# EAGLE design remote (EAGLE 6.2)
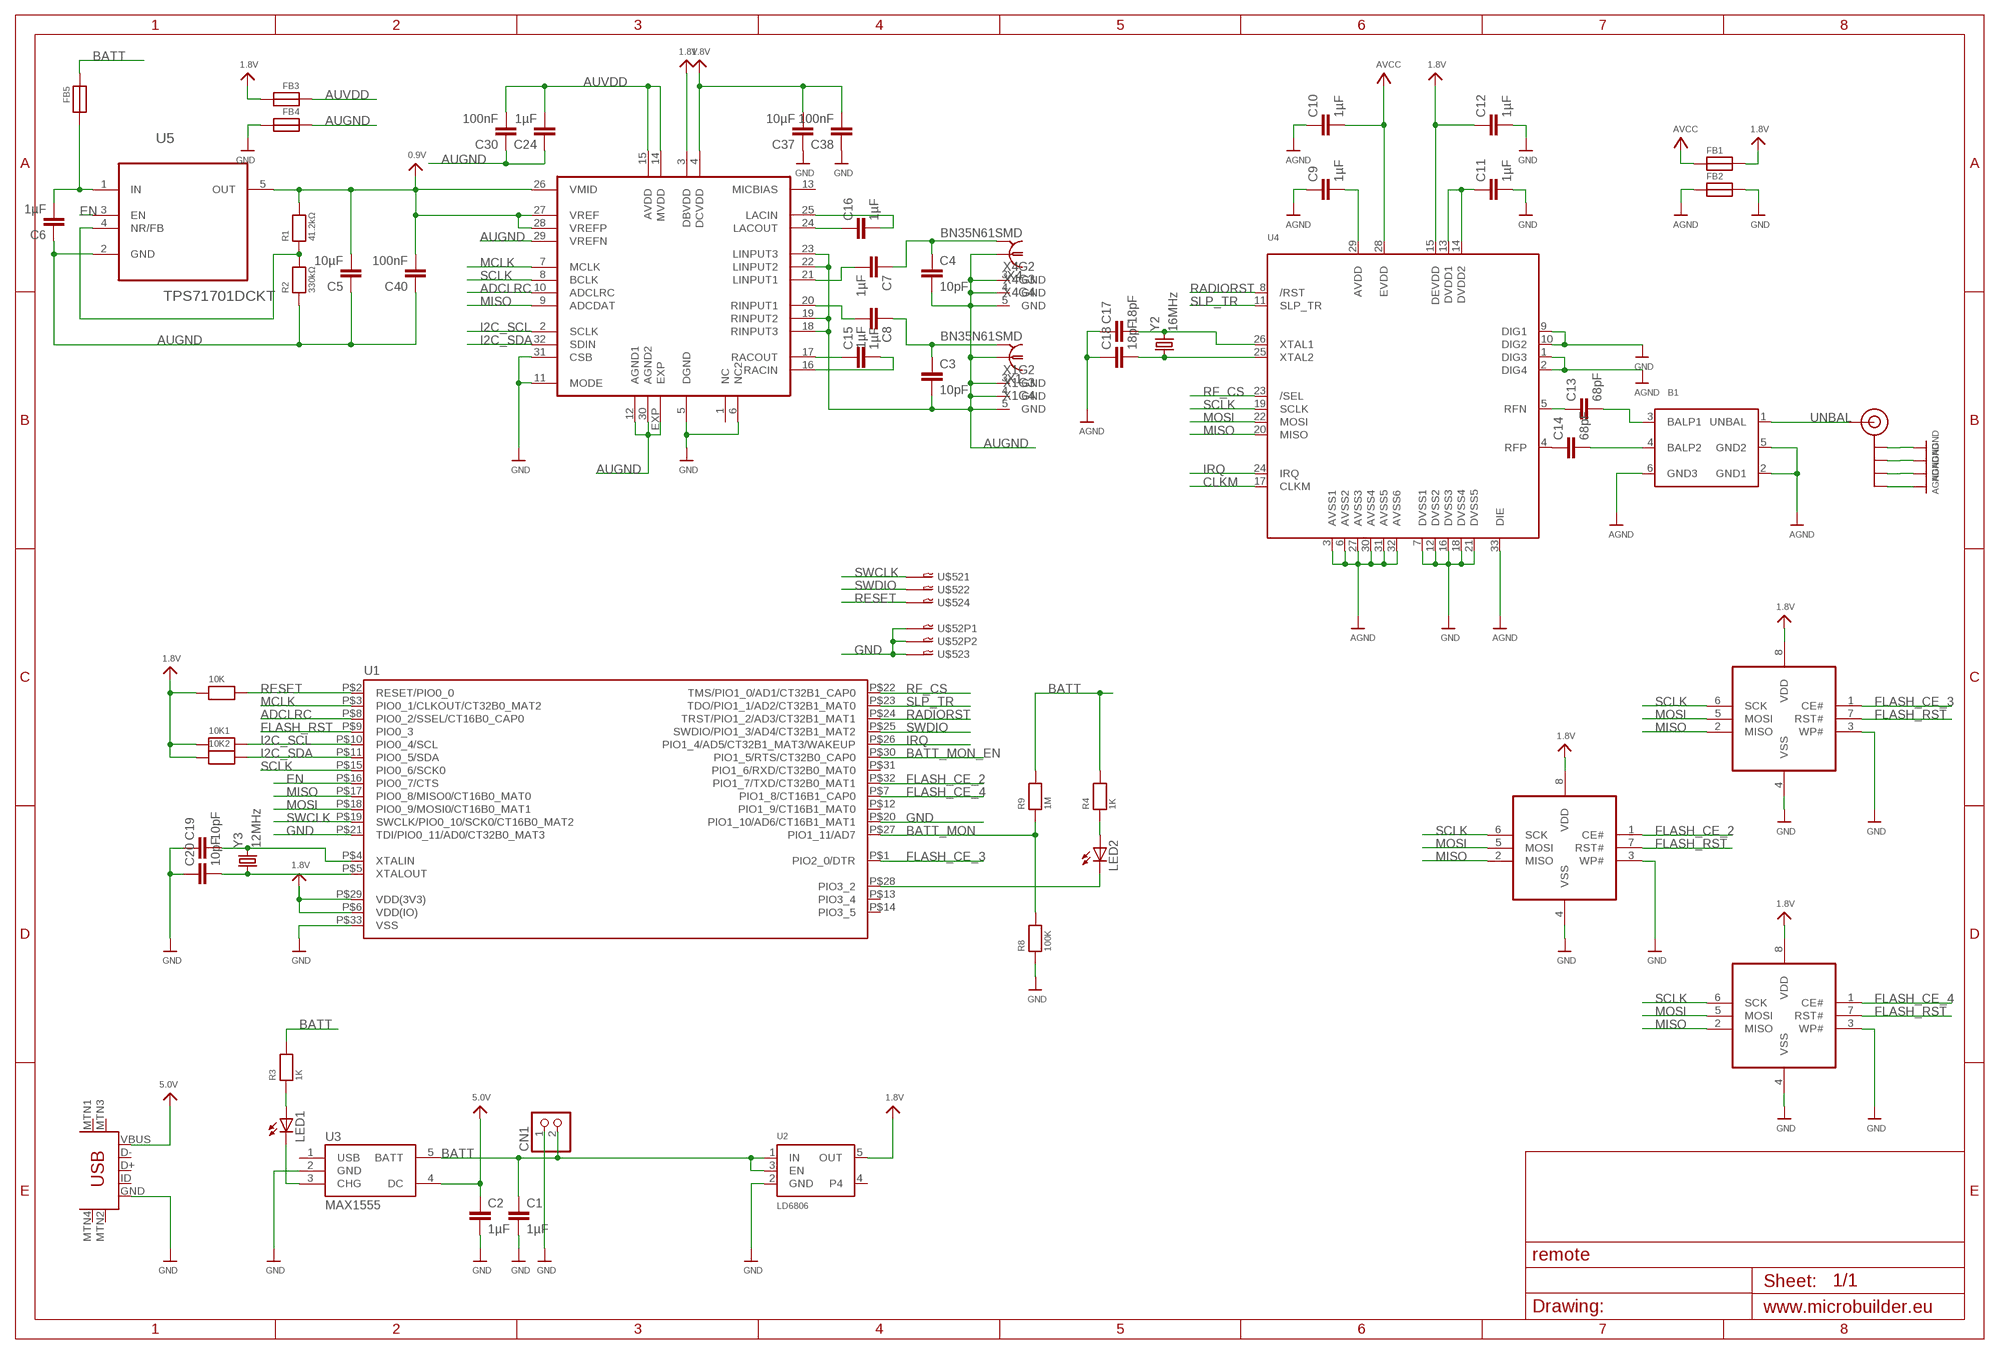
[diagram p0: schematic, sheet 1]

## Parts
10K  RESISTOR0603MINI  [0603-MINI]
10K1  RESISTOR0603MINI  [0603-MINI]
10K2  RESISTOR0603MINI  [0603-MINI]
B1  BALUN+LP  [BALUN0805]
C1  1µF  C-EUC0603K  [C0603K]
C2  1µF  C-EUC0603K  [C0603K]
C3  10pF  C-EUC0603K  [C0603K]
C4  10pF  C-EUC0603K  [C0603K]
C5  10µF  C-EUC0603K  [C0603K]
C6  1µF  C-EUC0603K  [C0603K]
C7  1µF  C-EUC0603K  [C0603K]
C8  1µF  C-EUC0603K  [C0603K]
C9  1µF  C-EUC0603K  [C0603K]
C10  1µF  C-EUC0603K  [C0603K]
C11  1µF  C-EUC0603K  [C0603K]
C12  1µF  C-EUC0603K  [C0603K]
C13  68pF  C-EUC0603K  [C0603K]
C14  68pF  C-EUC0603K  [C0603K]
C15  1µF  C-EUC0603K  [C0603K]
C16  1µF  C-EUC0603K  [C0603K]
C17  18pF  C-EUC0603K  [C0603K]
C18  18pF  C-EUC0603K  [C0603K]
C19  10pF  C-EUC0603K  [C0603K]
C20  10pF  C-EUC0603K  [C0603K]
C24  1µF  C-EUC0603K  [C0603K]
C30  100nF  C-EUC0603K  [C0603K]
C37  10µF  C-EUC0603K  [C0603K]
C38  100nF  C-EUC0603K  [C0603K]
C40  100nF  C-EUC0603K  [C0603K]
CN1  JST_2PIN  [JSTPH2]
FB1  FERRITE  [0603]
FB2  FERRITE  [0603]
FB3  FERRITE  [0603]
FB4  FERRITE  [0603]
FB5  FERRITE  [0603]
J$1  SMA_EDGE  [SMA-EDGE]
LED1  LEDCHIPLED_0603  [CHIPLED_0603]
LED2  LEDCHIPLED_0603  [CHIPLED_0603]
R1  41.2kΩ  RESISTOR0603MINI  [0603-MINI]
R2  330kΩ  RESISTOR0603MINI  [0603-MINI]
R3  1K  RESISTOR0603MINI  [0603-MINI]
R4  1K  RESISTOR0603MINI  [0603-MINI]
R8  100K  RESISTOR0603MINI  [0603-MINI]
R9  1M  RESISTOR0603MINI  [0603-MINI]
U1  LPC1113/4_QFN  [HVQFN33-7X7]
U2  LD6806  VREG_SOT23-5  [SOT23-5]
U3  MAX1555  [SOT23-5]
U4  AT86RF212  [32QN2]
U5  TPS71701DCKT  [SOT65P210X110-5N]
U$1  SST25WF  [ZA]
U$14  WM8737  [DM030FL]
U$16  USB-MINIB-5PIN  [USB-MINIB]
U$22  SST25WF  [ZA]
U$26  SST25WF  [ZA]
U$52  SM04B-SURS-TF  [SM04B-SURS-TF]
X1  BN35N61SMD  [B35N61_SMD]
X4  BN35N61SMD  [B35N61_SMD]
Y2  16MHz  CRYSTAL5X3  [CRYSTAL-SMD-5X3]
Y3  12MHz  CRYSTAL5X3  [CRYSTAL-SMD-5X3]

## Nets
0.9V: C5.2 C40.2 R1.2 U5.5(OUT) U$14.26(VMID) U$14.27(VREF) U$14.28(VREFP)
1.8V: 10K1.1 10K2.1 10K.1 C12.1 C37.2 C38.2 FB1.2 FB3.2 U1.P$6(VDD(IO)) U1.P$29(VDD(3V3)) U2.5(OUT) U4.15(DEVDD) U$1.8(VDD) U$14.3(DBVDD) U$14.4(DCVDD) U$22.8(VDD) U$26.8(VDD)
5.0V: C2.1 U3.4(DC) U$16.VBUS
ADCLRC: U1.P$8(PIO0_2/SSEL/CT16B0_CAP0) U$14.10(ADCLRC)
AGND: B1.2(GND1) B1.5(GND2) B1.6(GND3) C9.1 C10.1 C17.1 C18.1 FB2.1 J$1.GND@0(GND) J$1.GND@1(GND) J$1.GND@2(GND) J$1.GND@3(GND) U4.1(DIG3) U4.2(DIG4) U4.3(AVSS1) U4.6(AVSS2) U4.27(AVSS3) U4.30(AVSS4) U4.31(AVSS5) U4.32(AVSS6) U4.33(DIE)
AUBATT: C6.2 FB5.2 U5.1(IN)
AUGND: C3.2 C4.2 C5.1 C6.1 C24.1 C30.1 C40.1 FB4.1 R2.1 U5.2(GND) U$14.12(AGND1) U$14.18(RINPUT3) U$14.19(RINPUT2) U$14.22(LINPUT2) U$14.23(LINPUT3) U$14.29(VREFN) U$14.30(AGND2) U$14.EXP X1.2 X1.3(GND) X1.4(GND) X1.5(GND) X4.2 X4.3(GND) X4.4(GND) X4.5(GND)
AUVDD: C24.2 C30.2 FB3.1 U$14.14(MVDD) U$14.15(AVDD)
AVCC: C10.2 FB1.1 U4.28(EVDD)
AVDD-IN: C9.2 U4.29(AVDD)
BALP1: B1.3(BALP1) C13.2
BALP2: B1.4(BALP2) C14.2
BATT: C1.1 CN1.2 FB5.1 R3.2 R4.2 R9.2 U2.1(IN) U2.3(EN) U3.5(BATT)
BATT_MON: R8.2 R9.1 U1.P$27(PIO1_11/AD7)
BATT_MON_EN: U1.P$30(PIO1_5/RTS/CT32B0_CAP0)
CHG: LED1.C U3.3(CHG)
CHG_LED: LED1.A R3.1
CHG_LED1: LED2.A R4.1
CLKM: U4.17(CLKM)
EN: U1.P$16(PIO0_7/CTS) U5.3(EN)
FLASH_CE_2: U1.P$32(PIO1_7/TXD/CT32B0_MAT1) U$26.1(CE#)
FLASH_CE_3: U1.P$1(PIO2_0/DTR) U$22.1(CE#)
FLASH_CE_4: U1.P$7(PIO1_8/CT16B1_CAP0) U$1.1(CE#)
FLASH_RST: U1.P$9(PIO0_3) U$1.7(RST#) U$22.7(RST#) U$26.7(RST#)
GND: C1.2 C2.2 C11.2 C12.2 C19.1 C20.1 C37.1 C38.1 CN1.1 FB2.2 FB4.2 R8.1 U1.P$20(PIO1_10/AD6/CT16B1_MAT1) U1.P$21(TDI/PIO0_11/AD0/CT32B0_MAT3) U1.P$33(VSS) U2.2(GND) U3.2(GND) U4.7(DVSS1) U4.9(DIG1) U4.10(DIG2) U4.12(DVSS2) U4.16(DVSS3) U4.18(DVSS4) U4.21(DVSS5) U$1.3(WP#) U$1.4(VSS) U$14.5(DGND) U$14.6(NC2) U$14.11(MODE) U$14.31(CSB) U$16.GND U$22.3(WP#) U$22.4(VSS) U$26.3(WP#) U$26.4(VSS) U$52.3 U$52.GND1 U$52.GND2
I2C_SCL: 10K1.2 U1.P$10(PIO0_4/SCL) U$14.2(SCLK)
I2C_SDA: 10K2.2 U1.P$11(PIO0_5/SDA) U$14.32(SDIN)
IRQ: U1.P$26(PIO1_4/AD5/CT32B1_MAT3/WAKEUP) U4.24(IRQ)
LPC_XTAL1: C19.2 U1.P$4(XTALIN) Y3.3
LPC_XTAL2: C20.2 U1.P$5(XTALOUT) Y3.1
MCLK: U1.P$3(PIO0_1/CLKOUT/CT32B0_MAT2) U$14.7(MCLK)
MISO: U1.P$17(PIO0_8/MISO0/CT16B0_MAT0) U4.20(MISO) U$1.2(MISO) U$14.9(ADCDAT) U$22.2(MISO) U$26.2(MISO)
MOSI: U1.P$18(PIO0_9/MOSI0/CT16B0_MAT1) U4.22(MOSI) U$1.5(MOSI) U$22.5(MOSI) U$26.5(MOSI)
N$1: LED2.C U1.P$28(PIO3_2)
N$2: C8.2 U$14.20(RINPUT1)
N$3: C3.1 C8.1 X1.1(GND)
N$4: C4.1 C7.1 X4.1(GND)
N$5: C11.1 U4.13(DVDD1) U4.14(DVDD2)
N$6: C7.2 U$14.21(LINPUT1)
N$7: C16.1 U$14.24(LACOUT)
N$8: C15.1 U$14.17(RACOUT)
N$9: C16.2 U$14.25(LACIN)
N$10: C15.2 U$14.16(RACIN)
N$11: R1.1 R2.2 U5.4(NR/FB)
RADIORST: U1.P$24(TRST/PIO1_2/AD3/CT32B1_MAT1) U4.8(/RST)
RESET: 10K.2 U1.P$2(RESET/PIO0_0) U$52.4
RF_CS: U1.P$22(TMS/PIO1_0/AD1/CT32B1_CAP0) U4.23(/SEL)
RF_XTAL1: C17.2 U4.26(XTAL1) Y2.3
RF_XTAL2: C18.2 U4.25(XTAL2) Y2.1
RFN: C13.1 U4.5(RFN)
RFP: C14.1 U4.4(RFP)
SCLK: U1.P$15(PIO0_6/SCK0) U4.19(SCLK) U$1.6(SCK) U$14.8(BCLK) U$22.6(SCK) U$26.6(SCK)
SLP_TR: U1.P$23(TDO/PIO1_1/AD2/CT32B1_MAT0) U4.11(SLP_TR)
SWCLK: U1.P$19(SWCLK/PIO0_10/SCK0/CT16B0_MAT2) U$52.1
SWDIO: U1.P$25(SWDIO/PIO1_3/AD4/CT32B1_MAT2) U$52.2
UNBAL: B1.1(UNBAL) J$1.SIG(SIGNAL)
Unconnected: U1.P$12(PIO1_9/CT16B1_MAT0) U1.P$13(PIO3_4) U1.P$14(PIO3_5) U1.P$31(PIO1_6/RXD/CT32B0_MAT0) U2.4 U3.1(USB) U$14.1(NC) U$14.13(MICBIAS) U$16.D+ U$16.D- U$16.ID U$16.MTN1(MTN2) U$16.MTN2(MTN3) U$16.MTN3(MTN1) U$16.MTN4

## Library data of the parts
10K 10K1 10K2 R1-R4 R8 R9 = microbuilder:RESISTOR: Resistors 0402 - 0402 Surface Mount Package 22 Ohm 1% 1/16W [Digikey: 311-22.0LRTR-ND] 33 Ohm 5% 1/16W 1.0K 5% 1/16W 1.5K 5% 1/16W 2.0K 1% 1/16W 10.0K 1% 1/16W [Digikey: 311-10.0KLRTR-ND] 10.0K 5% 1/16W [Digikey: RMCF0402JT10K0TR-ND] 12.1K 1% 1/16W [Digikey: 311-22.0LRTR-ND] 100.0K 5% 1/16W 0603 - 0603 Surface Mount Package 0 Ohm 1/10 Watt 1% Resistor 15 Ohm 1/10 Watt 1% Resistor 33 Ohm 1/10 Watt 1% Resistor 49.9 Ohm 1/10 Watt 1% Resistor 100 Ohm 1/10 Watt 1% Resistor 150 Ohm 1/10 Watt 1% Resistor 240 Ohm 1/10 Watt 1% Resistor 390 Ohm 1/10 Watt 1% Resistor 560 Ohm 1/10 Watt 1% Resistor 680 Ohm 1/10 Watt 1% Resistor 750 Ohm 1/10 Watt 1% Resistor 1.0K Ohm 1/10 Watt 1% Resistor 1.5K Ohm 1/10 Watt 1% Resistor 2.0K Ohm 1/10 Watt 1% Resistor 2.2K Ohm 1/10 Watt 1% Resistor 3.3K Ohm 1/10 Watt 1% Resistor 4.7K Ohm 1/10 Watt 1% Resistor 10.0K Ohm 1/10 Watt 1% Resistor 12.0K Ohm 1/10 Watt 1% Resistor 12.1K Ohm 1/10 Watt 1% Resistor 20.0K Ohm 1/10 Watt 1% Resistor 33.0K Ohm 1/10 Watt 1% Resistor 100.0K Ohm 1/10 Watt 1% Resistor 0805 - 0805 Surface Mount Package 0 Ohm 1/8 Watt 1% Resistor 33 Ohm 1/8 Watt 1% Resistor 100 Ohm 1/8 Watt 1% Resistor 150 Ohm 1/8 Watt 1% Resistor 200 Ohm 1/8 Watt 1% Resistor 240 Ohm 1/8 Watt 1% Resistor 330 Ohm 1/8 Watt 1% Resistor 390 Ohm 1/8 Watt 1% Resistor 470 Ohm 1/8 Watt 1% Resistor 1.0K Ohm 1/8 Watt 1% Resistor 1.5K Ohm 1/8 Watt 1% Resistor 2.0K Ohm 1/8 Watt 1% Resistor 4.7K Ohm 1/8 Watt 1% Resistor 5.1K Ohm 1/8 Watt 1% Resistor 5.6K Ohm 1/8 Watt 1% Resistor 10.0K Ohm 1/8 Watt 1% Resistor 22.0K Ohm 1/8 Watt 1% Resistor 33.0K Ohm 1/8 Watt 1% Resistor 100K Ohm 1/8 Watt 1% Resistor 1206 - 1206 Surface Mount Package 2012 - 2010 Surface Mount Package 0.11 Ohm 1/2 Watt 1% Resistor - Digikey: RHM.11UCT-ND
B1 = microbuilder:BALUN+LP: Balun + Low Pass Filter 0805 863-928 MHz Balun + Low Pass Filter (0805) - Digikey: 712-1473-1-ND
C1-C20 C24 C30 C37 C38 C40 = resistor:C-EU: CAPACITOR, European symbol
CN1 = microbuilder:JST_2PIN: JST 2-Pin Right-Angle Connector PH-Series - 4UConnector: 17311 SH-Series - 4UConnector: 07278
FB1-FB5 = microbuilder:FERRITE: Ferrite Bead 0603 MMZ1608B121C - 120 Ohm, 600mA Ferrite Chip - Digikey: 445-2164-1-ND BK1608HW121-T - 120 Ohm, 600mA Ferrite Chip - Digikey: 587-1876-2-ND
J$1 = SparkFun:SMA_EDGE: SMA Antenna Connector End launch SMA connector. The paste layer has been removed so that the connector can be hand soldered onto the board after reflow.
LED1 LED2 = led:LED: LED OSRAM: - CHIPLED LG R971, LG N971, LY N971, LG Q971, LY Q971, LO R971, LY R971 LH N974, LH R974 LS Q976, LO Q976, LY Q976 LO Q996 - Hyper CHIPLED LW Q18S LB Q993, LB Q99A, LB R99A - SideLED LS A670, LO A670, LY A670, LG A670, LP A670 LB A673, LV A673, LT A673, LW A673 LH A674 LY A675 LS A676, LA A676, LO A676, LY A676, LW A676 LS A679, LY A679, LG A679 - Hyper Micro SIDELED® LS Y876, LA Y876, LO Y876, LY Y876 LT Y87S - SmartLED LW L88C, LW L88S LB L89C, LB L89S, LG L890 LS L89K, LO L89K, LY L89K LS L896, LA L896, LO L896, LY L896 - TOPLED LS T670, LO T670, LY T670, LG T670, LP T670 LSG T670, LSP T670, LSY T670, LOP T670, LYG T670 LG T671, LOG T671, LSG T671 LB T673, LV T673, LT T673, LW T673 LH T674 LS T676, LA T676, LO T676, LY T676, LB T676, LH T676, LSB T676, LW T676 LB T67C, LV T67C, LT T67C, LS T67K, LO T67K, LY T67K, LW E67C LS E67B, LA E67B, LO E67B, LY E67B, LB E67C, LV E67C, LT E67C LW T67C LS T679, LY T679, LG T679 LS T770, LO T770, LY T770, LG T770, LP T770 LB T773, LV T773, LT T773, LW T773 LH T774 LS E675, LA E675, LY E675, LS T675 LS T776, LA T776, LO T776, LY T776, LB T776 LHGB T686 LT T68C, LB T68C - Hyper Mini TOPLED® LB M676 - Mini TOPLED Santana® LG M470 LS M47K, LO M47K, LY M47K Source: http://www.osram.convergy.de LUXEON: - LUMILED® LXK2-PW12-R00, LXK2-PW12-S00, LXK2-PW14-U00, LXK2-PW14-V00 LXK2-PM12-R00, LXK2-PM12-S00, LXK2-PM14-U00 LXK2-PE12-Q00, LXK2-PE12-R00, LXK2-PE12-S00, LXK2-PE14-T00, LXK2-PE14-U00 LXK2-PB12-K00, LXK2-PB12-L00, LXK2-PB12-M00, LXK2-PB14-N00, LXK2-PB14-P00, LXK2-PB14-Q00 LXK2-PR12-L00, LXK2-PR12-M00, LXK2-PR14-Q00, LXK2-PR14-R00 LXK2-PD12-Q00, LXK2-PD12-R00, LXK2-PD12-S00 LXK2-PH12-R00, LXK2-PH12-S00 LXK2-PL12-P00, LXK2-PL12-Q00, LXK2-PL12-R00 Source: www.luxeon.com KINGBRIGHT: KA-3528ASYC Source: www.kingbright.com
U1 = microbuilder:LPC1113/4_QFN: LPC1113/4 ARM Cortex-M0 processor, running at frequencies of up to 50 MHz. QFN 33 Pin Package; DIGIKEY#: 568-4948-ND; MANF: NXP; MANF#: LPC1114FHN33/301,5
U2 = microbuilder_v2:VREG_SOT23-5: SOT23-5 Fixed Voltage Regulators To better organise some of the SOT23-5 fixed voltage regulators in this library, this new part was created. Part Current Out V Out V In V Dropout Digikey Part No. ADP121 150mA 3.3V 3.4-5.5V 0.09V @ 150mA ADP121-AUJZ33R7CT-ND ADP121 150mA 3.0V 3.1-5.5V 0.09V @ 150mA ADP121-AUJZ30R7CT-ND ADP122 300mA 3.3V 3.4-5.5V 0.085V @ 300mA ADP122AUJZ-3.3-R7CT-ND ADP1712 300mA 3.3V 3.5-5.5V 0.17V @ 300mA ADP1712AUJZ-3.3-R7TR-ND AP7311 (Low Cost) 150mA 3.3V 3.5-6V 0.15V @ 150mA AP7311-33WG-7DICT-ND LD39015M18R 150mA 1.8V 1.9V-5.5V 0.08V @ 100mA 497-6977-1-ND MCP1824T-3302E/OT 300mA 3.3V 3.5V-6V 0.2V @ 300mA MCP1824T-3302E/OTCT-ND MIC5205-2.5YM5 TR 150mA 2.5V 2.7-16V 0.165V @ 150mA 576-1257-2-ND MIC5205-3.0YM5 TR 150mA 3.0V 3.2V-16V 0.165V @ 150mA 576-1258-2-ND MIC5205-3.3YM5 TR 150mA 3.3V 3.5V-16V 0.165V @ 150mA 576-1259-2-ND TPS780330220 150mA 3.3V+2.2V 3.6-5.5V 250mV Max 296-23332-1-ND TDA3663/N1,135 100mA 3.3V 3.5-45V 0.18V @ 50mA 568-5343-1-ND
U3 = SparkFun:MAX1555: MAX1555 Lithium Charger IC SOT-23 Lithium Polymer charging IC. Schematic element and footprint proven. Spark Fun Electronics SKU : COM-00674
U4 = microbuilder:AT86RF212: AT86RF212 - Low-Power SPI-based 700/800/900 MHz Transceiver Digikey: AT86RF212-ZU-ND
U5 = TPS71701:TPS71701DCKT: Linear Regulator; MPN: TPS71701DCKT; OC_FARNELL: 1703393; OC_NEWARK: 65M6356; PACKAGE: SC-70-5; SUPPLIER: Texas Instruments
U$1 U$22 U$26 = sst25wf:SST25WF
U$14 = wm8737:WM8737
U$16 = SparkFun:USB-MINIB: Mini-USB "B" connector with 5th pin broken out. Created new symbol breaking out 5th "ID" pin in mini/micro USB connector spec. See: http://en.wikipedia.org/wiki/Mini_usb#Cables. Uses same footprint as 4-pin symbol. Also added pins to connect to mounting / shield pads if required (probably not generally needed as signals aren't shielded once they leave the connector).
U$52 = con-jst:SM04B-SURS-TF
X1 X4 = con-coax:BN35N61: BNC CONNECTOR M/A COM www.macom.com distributor Farnell 149-452
Y2 Y3 = SparkFun:CRYSTAL: Crystals Various standard crystals. Proven footprints. Spark Fun Electronics SKU : COM-00534

## Board
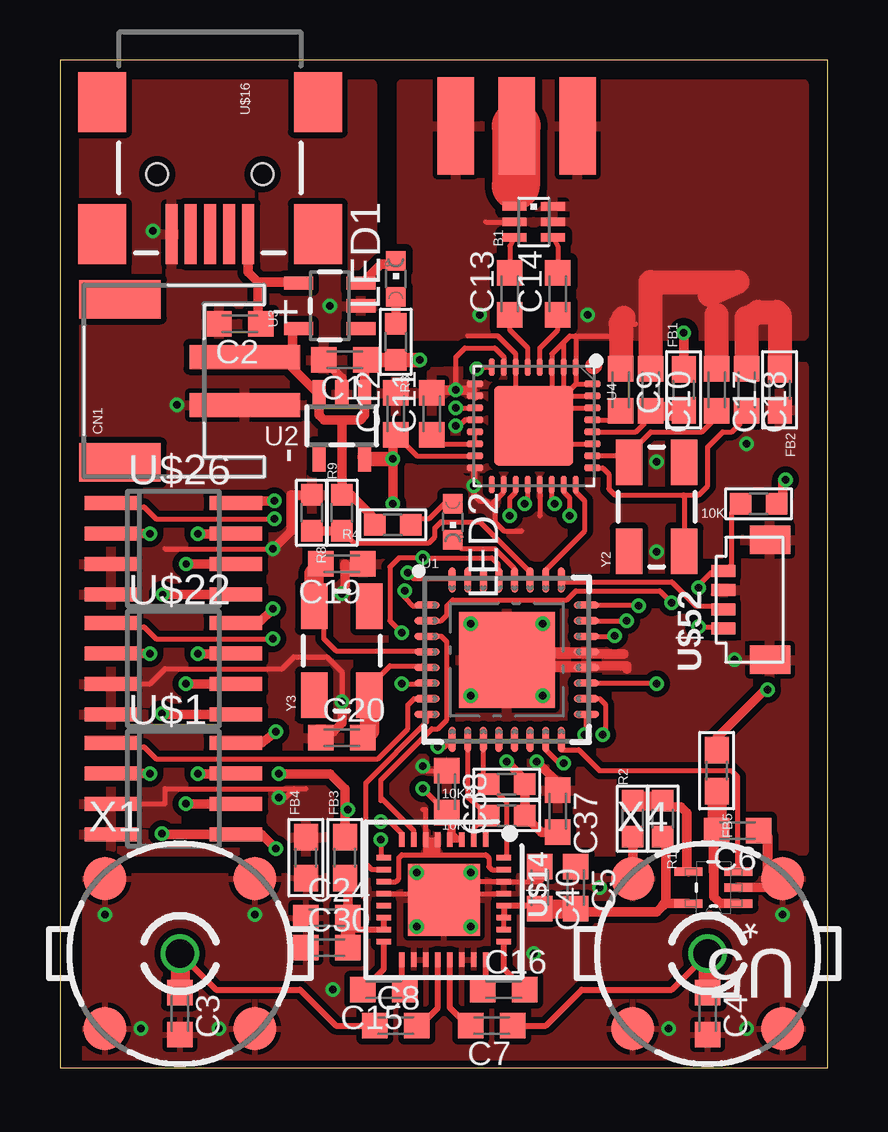
[diagram p1: board, top side]
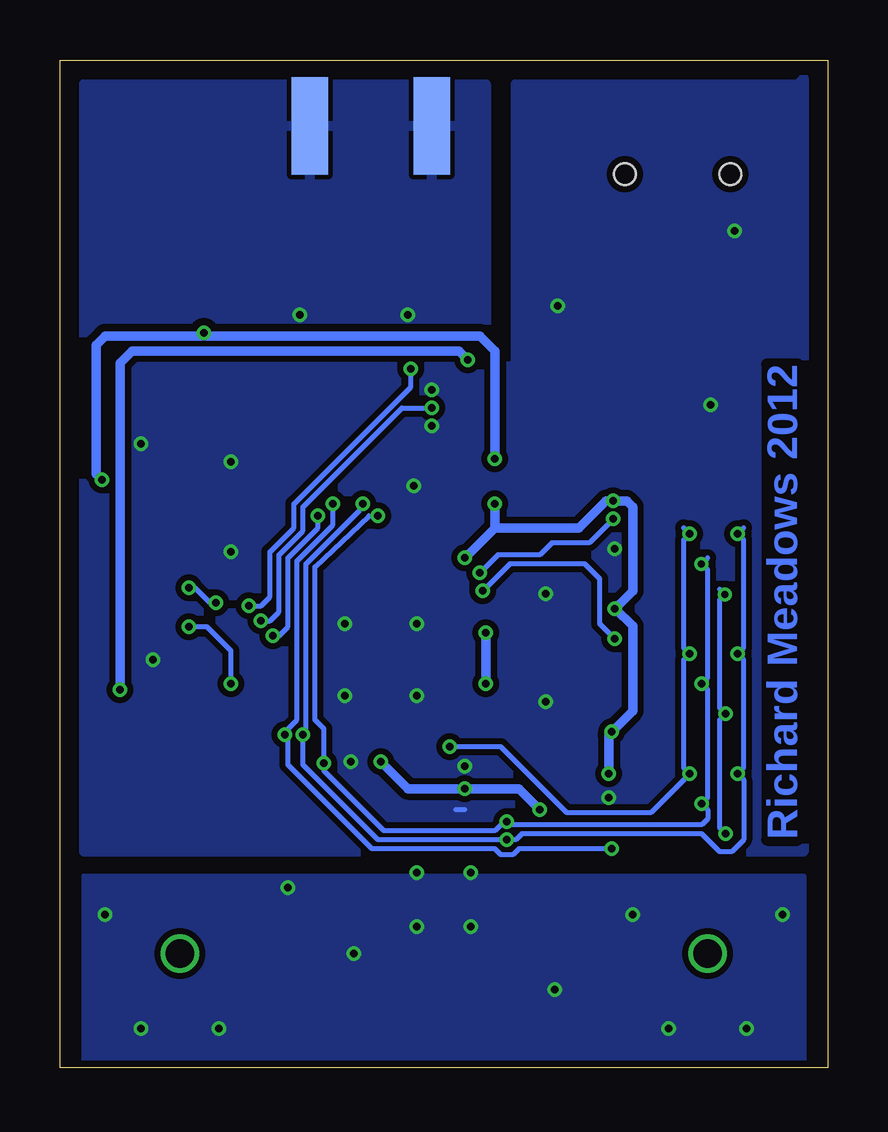
[diagram p2: board, bottom side, seen from below]

Size 32 x 42 mm. Coordinates in mm from the lower left corner, seen from the top.
Outline: 0,0 32,0 32,42 0,42 0,0
Copper layers (1*16): Top 0.035mm / dielectric 1.5mm / Bottom 0.035mm
Design rules: minimum track width 0.15mm, minimum drill 0.3mm, track to track 0.15mm, track to pad 0.15mm, pad to pad 0.15mm, via to via 0.15mm, smd to smd 0.15mm, copper to edge 0.3mm, drill to drill 0.2mm, minimum pad ring 0.2mm, minimum via ring 0.15mm, stop-mask expansion 0.075mm, vias tented up to drill 0mil, thermal gap 0.2mm

### Footprints (pad centres in the part's own frame; a part is rotated, then mirrored left to right if it is on the bottom)
0603-MINI = smd 0.9 x 0.9: 1 -0.75,0; 2 0.75,0
BALUN0805 = smd 0.35 x 1: 1 0.65,0.8; 2 0,0.8; 3 -0.65,0.8; 4 -0.65,-0.8; 5 0,-0.8; 6 0.65,-0.8
C0603K = smd 1.05 x 1.08: 1 -0.875,0; 2 0.875,0
JSTPH2 = smd 1 x 4.6: 1 -1,-3.7; 2 1,-3.7 | smd 1.6 x 3.4: NC1 -3.4,1.5; NC2 3.4,1.5
0603 = smd 1.1 x 1: 1 -0.85,0; 2 0.85,0
SMA-EDGE = smd 1.524 x 4.064: GND@0 0,0; GND@1 5.08,0; SIG 2.54,0 | smd 1.524 x 4.064 bottom: GND@2 0,0; GND@3 5.08,0
CHIPLED_0603 = smd 0.8 x 0.8: A 0,-0.75; C 0,0.75
HVQFN33-7X7 = smd 1.067 x 0.3: P$1 -3.327,2.275; P$2 -3.327,1.625; P$3 -3.327,0.975; P$4 -3.327,0.325; P$5 -3.327,-0.325; P$6 -3.327,-0.975; P$7 -3.327,-1.625; P$8 -3.327,-2.275; P$17 3.327,-2.275; P$18 3.327,-1.625; P$19 3.327,-0.975; P$20 3.327,-0.325; P$21 3.327,0.325; P$22 3.327,0.975; P$23 3.327,1.625; P$24 3.327,2.275 | smd 0.3 x 1.067: P$9 -2.275,-3.327; P$10 -1.625,-3.327; P$11 -0.975,-3.327; P$12 -0.325,-3.327; P$13 0.325,-3.327; P$14 0.975,-3.327; P$15 1.625,-3.327; P$16 2.275,-3.327; P$25 2.275,3.327; P$26 1.625,3.327; P$27 0.975,3.327; P$28 0.325,3.327; P$29 -0.325,3.327; P$30 -0.975,3.327; P$31 -1.625,3.327; P$32 -2.275,3.327 | smd 4 x 4: P$33 0,0
SOT23-5 = smd 0.55 x 1.2: 1 -0.95,-1.3; 2 0,-1.3; 3 0.95,-1.3; 4 0.95,1.3; 5 -0.95,1.3
32QN2 = smd 0.7 x 0.25: 1 -2.45,1.75; 2 -2.45,1.25; 3 -2.45,0.75; 4 -2.45,0.25; 5 -2.45,-0.25; 6 -2.45,-0.75; 7 -2.45,-1.25; 8 -2.45,-1.75; 17 2.45,-1.75; 18 2.45,-1.25; 19 2.45,-0.75; 20 2.45,-0.25; 21 2.45,0.25; 22 2.45,0.75; 23 2.45,1.25; 24 2.45,1.75 | smd 0.25 x 0.7: 9 -1.75,-2.45; 10 -1.25,-2.45; 11 -0.75,-2.45; 12 -0.25,-2.45; 13 0.25,-2.45; 14 0.75,-2.45; 15 1.25,-2.45; 16 1.75,-2.45; 25 1.75,2.45; 26 1.25,2.45; 27 0.75,2.45; 28 0.25,2.45; 29 -0.25,2.45; 30 -0.75,2.45; 31 -1.25,2.45; 32 -1.75,2.45 | smd 3.3 x 3.3: 33 0,0
SOT65P210X110-5N = smd 1.168 x 0.356: 1 -1.041,0.66; 2 -1.041,0; 3 -1.041,-0.66; 4 1.041,-0.66; 5 1.041,0.66
ZA = smd 0.6 x 2.2: 1 -1.905,-2.87; 2 -0.635,-2.87; 3 0.635,-2.87; 4 1.905,-2.87; 5 1.905,2.33; 6 0.635,2.33; 7 -0.635,2.33; 8 -1.905,2.33
DM030FL = smd 0.6 x 0.23: 1 -2.5,1.75; 2 -2.5,1.25; 3 -2.5,0.75; 4 -2.5,0.25; 5 -2.5,-0.25; 6 -2.5,-0.75; 7 -2.5,-1.25; 8 -2.5,-1.75; 17 2.5,-1.75; 18 2.5,-1.25; 19 2.5,-0.75; 20 2.5,-0.25; 21 2.5,0.25; 22 2.5,0.75; 23 2.5,1.25; 24 2.5,1.75 | smd 0.23 x 0.6: 9 -1.75,-2.5; 10 -1.25,-2.5; 11 -0.75,-2.5; 12 -0.25,-2.5; 13 0.25,-2.5; 14 0.75,-2.5; 15 1.25,-2.5; 16 1.75,-2.5; 25 1.75,2.5; 26 1.25,2.5; 27 0.75,2.5; 28 0.25,2.5; 29 -0.25,2.5; 30 -0.75,2.5; 31 -1.25,2.5; 32 -1.75,2.5 | smd 3 x 3: EXP 0,0
USB-MINIB = smd 2.5 x 0.5: D+ 2.5,0; D- 2.5,0.8; GND 2.5,-1.6; ID 2.5,-0.8; VBUS 2.5,1.6 | smd 2.5 x 2: MTN1 -3,4.5; MTN2 2.5,4.5; MTN3 -3,-4.5; MTN4 2.5,-4.5 | hole 0.9: 0,2.2; 0,-2.2
SM04B-SURS-TF = smd 0.5 x 1: 1 -1.2,1.1; 2 -0.4,1.1; 3 0.4,1.1; 4 1.2,1.1 | smd 1.2 x 1.7: GND1 -2.5,-0.85; GND2 2.5,-0.85
B35N61_SMD = drill 1.2: 1 0,0 | smd 1.8 x 1.8: 2 -3.125,3.125; 3 3.125,3.125; 4 -3.125,-3.125; 5 3.125,-3.125
CRYSTAL-SMD-5X3 = smd 1.9 x 1.1: 1 -1.85,-1.15; 2 1.85,-1.15; 3 1.85,1.15; 4 -1.85,1.15

### Placement (x,y rotation side)
10K  29.12,23.5 180 top
10K1  18.62,10.5 180 top
10K2  18.62,11.81 180 top
B1  19.75,35.25 90 top
C1  11.88,29.5 180 top
C2  7.5,31 180 top
C3  5,2.25 270 top
C4  27,2.25 270 top
C5  21.5,7.5 270 top
C6  28.25,9.88 180 top
C7  18,1.75 180 top
C8  14,1.75 0 top
C9  23.38,28.25 270 top
C10  24.62,28.25 270 top
C11  15.5,27.25 90 top
C12  14,27.25 90 top
C13  18.75,32.25 90 top
C14  20.75,32.25 90 top
C15  13.5,3.25 180 top
C16  18.5,3.25 0 top
C17  27.38,28.25 270 top
C18  28.62,28.25 270 top
C19  11.75,21 180 top
C20  11.75,13.75 0 top
C24  11.12,6.25 0 top
C30  11.12,5 0 top
C37  20.75,10.69 270 top
C38  16.12,11.5 270 top
C40  20,7.5 270 top
CN1  4,28.62 90 top
FB1  26,28.25 90 top
FB2  30,28.25 270 top
FB3  11.88,8.75 90 top
FB4  10.25,8.75 90 top
FB5  27.38,12.38 270 top
J$1  16.5,39.25 0 top
LED1  14,32.88 0 top
LED2  16.38,22.75 180 top
R1  25.12,10.38 270 top
R2  23.88,10.38 90 top
R3  14,30.25 270 top
R4  13.88,22.62 180 top
R8  10.5,23.12 270 top
R9  11.75,23.12 90 top
U1  18.62,17 0 top
U2  11.75,26.75 180 top
U3  11.25,31.75 90 top
U4  19.75,26.75 270 top
U5  27.25,7.5 180 top
U$1  5,11.62 270 top
U$14  16,7 270 top
U$16  6.25,37.25 270 top
U$22  5,16.62 270 top
U$26  5,21.62 270 top
U$52  28.75,19.5 90 top
X1  5,4.75 0 top
X4  27,4.75 0 top
Y2  24.88,23.38 90 top
Y3  11.75,17.38 90 top

### Tracks (layer width: path | path; a pad name or v marks a point on that pad's centre or on a via)
0.9V
  Top 0.2: U$14.26 U$14.28
  Top 0.25: U$14.27 U$14.28 20.25,6.75 C40.2
  Top 0.4: 21.5,6.5 24.88,6.5 25.12,6.75 | U5.5 25.22,6.84 25.25,6.88 25.25,9.5
  Top 0.406: 21.5,6.88 C5.2 21.5,6.5 | 25.12,6.75 25.22,6.84 | R1.2 25.25,9.5
  Top 0.8: C40.2 C5.2
1.8V  (via drill 0.3)
  Top 0.2: 16.25,9.88 U$14.4 U$14.3 16.62,9.5 16.38,9.75 | 16.38,9.75 16.25,9.88 | 16.25,9.88 16.25,10.5 C38.2 | C38.2 16.38,10.38 16.38,9.75 | v15.12,11.62 C38.2 | C12.1 14.88,25.5 U4.15 | v14.25,16 15.27,16 U1.P$6 | v14.25,18.12 13.75,18.62 13.75,20.88 14.12,21.25 v15.12,21.25 18,21.25 18.25,21 18.25,20.38 U1.P$29
  Top 0.4: v26,30.62 FB1.2 | v18.62,12.75 19.38,12 10K2.1 10K1.1 20.06,9.81 C37.2 | v30.25,24.5 30.12,24.38 30.12,23.75 10K.1 | U$1.8 8.4,13.53 v9,14 | U$22.8 8.28,18.53 v8.88,19.12 | U$26.8 8.28,23.53 8.38,23.62 v8.94,23.62 | v13.88,23.5 v13.88,25.38 13.88,26.38 C12.1 | v9.12,12.25 11.25,12.25 11.88,11.62 11.88,10.75 | 11.88,10.75 FB3.2 | v12,10.75 11.88,10.75
  Top 0.6: U2.5 12.78,25.38 v13.88,25.38
  Bottom 0.4: v18.62,12.75 17.5,11.62 v15.12,11.62 12.88,11.62 v12,10.75 | v13.88,25.38 13.88,29.88 14.5,30.5 25.88,30.5 v26,30.62 26,30.5 30.12,30.5 30.5,30.12 30.5,24.75 v30.25,24.5 | v14.25,18.12 v14.25,16 | v9.12,12.25 9.12,13.88 v9,14 8.12,14.88 8.12,18.41 8.85,19.12 v8.88,19.12 8.12,19.88 8.12,23.38 8.38,23.62 v8.94,23.62 9.25,23.62 10.38,22.5 13.88,22.5 | v13.88,23.5 13.88,22.5 | 13.88,22.5 v15.12,21.25
5.0V
  Top 0.4: U$16.VBUS 7.85,33.15 8.25,32.75 | 8.25,32.75 9.4,32.75 U3.4 | 8.25,32.75 8.25,31 C2.1
ADCLRC
  Top 0.2: U$14.10 13,8.25 12.75,8.5 12.75,11.88 15.3,14.42 U1.P$8
AGND  (via drill 0.3)
  Top 0.15: 21,29 U4.2 | 19,29 U4.6
  Top 0.2: U4.6 19,29.75 18.25,30.5 17,30.5 | 21,30.25 20.5,29.75 U4.3 20.5,28 | 21.5,30.5 21.25,30.5 21,30.25 | 17.75,35.25 B1.2 | 21.25,27.5 20.5,27.5 U4.33 | 21.25,27.5 U4.30 | 21.25,28 21,28 21,29 | 22.25,28 U4.31 21.25,28 | 21.5,30.5 U4.1 21.5,28.5 | U4.2 21,30.25 | 21.5,28.5 U4.32 22.25,28.5 | 21.5,28.5 21.25,28.25 | 22.25,26 U4.27 20.5,26 U4.33 | 19,29 19,27.5 U4.33 | 21.5,30.5 23.12,30.5 23.38,31 24,31 | 21.25,27.5 21.25,28
  Top 1: C9.1 23.38,31 23.5,31.25 | C17.1 27.38,31.38 | 27.07,32.22 28.25,32.75 24.62,32.75 C10.1 | C18.1 28.62,31.25 29.11,31.5 29.88,31.5 30,31.38 FB2.1
  other vias: 17.5,31.38 22,31.38
  pour Top (isolate 0.305): 14.25,41 31,41 31,30.5 14.25,30.5
  pour Bottom (isolate 0.305): 14.25,41 14.25,30.5 31,30.5 31,41
AUBATT
  Top 0.4: U5.1 27.53,6.84 27.25,7.12 27.25,8.16
  Top 0.406: 27.25,8.16 27.25,9.5 C6.2
  Top 0.8: FB5.2 C6.2
AUGND  (via drill 0.3)
  Top 0.2: U$14.12 U$14.29 | v17.12,8.12 17.5,7.75 U$14.30 19.88,7.75 20,7.88
  Top 0.4: U5.2 29.5,7.5 X4.3 | C40.1 20,7.88 | R2.1 X4.2
  Top 0.406: X4.3 29.5,7.88 29.5,9.62 C6.1
  other vias: 14.88,8.12 14.88,5.88 17.12,5.88 30.12,6.38 22.5,7.5 28.62,1.62 25.38,1.62 19.75,4.75 8.12,6.38 1.88,6.38 6.62,1.62 3.38,1.62 11.38,3.25
  pour Top (isolate 0.254): 1,8 1,0 31,0 31,8
  pour Bottom (isolate 0.254): 1,8 1,0 31,0 31,8
AUVDD
  Top 0.25: U$14.14 U$14.15 12,5.75
  Top 0.4: FB3.1 12.03,7.9 12,7.62 12,5.75
  Top 0.6: C30.2 12,5.75 C24.2
AVCC
  Top 0.2: U4.28 24,26.5 24.38,26.88 24.38,27.12 C10.2
  Top 0.8: C10.2 25.98,27.38 FB1.1
AVDD-IN
  Top 0.2: U4.29 23.38,27 C9.2
BALP1
  Top 0.2: B1.3 18.75,34.25 C13.2
BALP2
  Top 0.2: B1.4 20.75,34.25 C14.2
BATT  (via drill 0.3)
  Top 0.4: C1.1 12.7,29.45 U2.1 12.7,27.2 12.5,27 11.75,27 | CN1.2 9.7,29.62 | U3.5 9.75,30.8 9.75,30.75 9.7,30.75 9.7,29.62 | 11.75,27 11,27 10.8,27.2 U2.3 9.45,29.4 9.7,29.62 | FB5.1 27.38,13.75 29.38,15.75 v29.5,15.75 | 11.75,27 R9.2 12.12,23.88 13.12,22.88 R4.2
  Top 0.6: C1.1 R3.2 v15,29.5
  Bottom 0.4: v29.5,15.75 29.5,29.38 29,29.88 15.38,29.88 v15,29.5
BATT_MON
  Top 0.2: U1.P$27 19.6,20.65 17.5,22.75 15.88,22.75 15.62,22.5 15.62,22.12 15.38,21.88 12.25,21.88 R9.1
  Top 0.4: R8.2 R9.1
CHG
  Top 0.4: U3.3 12.6,32.75 12.62,32.75 13.38,33.5 14,33.5 LED1.C
CHG_LED
  Top 0.4: R3.1 LED1.A
CHG_LED1
  Top 0.2: LED2.A 16,23.5 15.38,22.88 14.88,22.88 R4.1
EN
  Top 0.2: U5.3 28.25,8.16 28.25,12.12 28,12.38 22.5,12.38 21.62,13.25 20.88,13.25 20.88,13.38 20.9,13.4 U1.P$16
FLASH_CE_2  (via drill 0.3)
  Top 0.2: U$26.1 2.97,23.53 3.12,23.38 3.5,23.38 4,22.88 v8.94,22.88 | U1.P$32 16.3,20.38 14.75,20.38 v14.5,20.62
  Bottom 0.2: v8.94,22.88 9.94,21.88 11.5,21.88 12,21.38 13.75,21.38 v14.5,20.62
FLASH_CE_3  (via drill 0.3)
  Top 0.2: U$22.1 2.29,18.38 3.5,18.38 4,17.88 v8.88,17.88 | U1.P$1 14.88,19.25 14.7,19.25 14.38,19.57 v14.38,19.88
  Bottom 0.2: v8.88,17.88 9.5,18.5 9.5,20.38 10.12,21 13.25,21 v14.38,19.88
FLASH_CE_4
  Top 0.2: U$1.1 2.13,13.38 3.5,13.38 4,12.88 13.25,12.88 14.5,14.12 14.5,15.12 14.75,15.38 U1.P$7
FLASH_RST  (via drill 0.3)
  Top 0.2: v15.75,13.38 16.05,13.38 U1.P$9
  Top 0.4: v5.75,22.25 U$26.7 | v5.75,17.25 U$22.7 | v5.75,12.25 U$1.7
  Bottom 0.2: 6,22.5 v5.75,22.25 6,22 6,17.5 v5.75,17.25 6,17 6,12.5 v5.75,12.25 7.38,10.62 10.88,10.62 13.62,13.38 v15.75,13.38
GND  (via drill 0.3)
  Top 0.2: U4.12 16.88,27 16.62,26.75 v16.5,26.75 | 15.25,8.88 15.62,8.88 | 15.62,8.88 15.75,8.88 | 15.75,8.88 17.75,8.88 17.88,8.75 17.88,8.38 18,8.25 U$14.31 | 15.75,8.88 U$14.5 15.62,9.5 | U$14.11 14,7.75 14.12,7.88 14.12,8.75 14.25,8.88 15.25,8.88 | 15.25,8.88 U$14.6 | U$14.6 15.38,9.5 | 15.62,8.88 15.62,9.5 | 15.38,9.5 15.62,9.5 | 15.38,9.5 15.38,9 15.5,9 15.5,9.38 | U$14.6 15.25,10.75 15.12,10.75 | C38.1 15.25,12.38 v15.12,12.56 | U$1.3 4.38,10.99 4.38,11.62 9.75,11.62 | v11.75,19.75 11.88,20.12 | 11.88,21 C19.1 | U$22.3 3.75,16 4.38,16.62 9.25,16.62 9.75,17.12 11.12,17.12 11.75,16.5 v11.75,15.25 | 4.38,21.62 v8.88,21.62 | U4.21 20,23 | U4.7 18.5,29.62 18.12,30 16.88,30 16.5,29.62 v16.5,28.25 | 19.25,22.38 18.5,22.38 18.12,22.75 18.12,23.25 17.88,23.5 | 17.88,23.5 17.75,23.62 17.5,23.62 17.25,23.88 v17.25,24.25 | U4.18 18.5,24 18,23.5 17.88,23.5 | 9.75,11.62 10.25,11.62 | 20.12,17.5 v20.12,18.5 | 20.3,17.32 20.3,17.3 20.25,17.25 | U4.10 U4.9 | v9.12,11.25 9.38,11.25 9.75,11.62
  Top 0.254: 17.25,24 v17.25,24.25 17.25,24.95 U4.16
  Top 0.4: C20.1 11.12,14 11.38,14 11.75,14.38 v11.75,15.25 | 11.88,20.12 11.88,21 | C11.2 15.62,28.25 v16.5,28.25 17.05,28.25 U4.10 | U1.P$21 20.3,17.32 20.12,17.5 19.12,17.5 U1.P$33 18.95,16.68 U1.P$20 | 20.12,17.25 20.25,17.25 23.5,17.25 | 23.62,16.62 23.62,16.75 19.88,16.75 | U2.2 11.75,28.75 C1.2 | 1.38,9.62 1.5,9.75 2.1,9.75 U$1.4 | C37.1 20.75,11.88 v19.88,12.75 | v8.88,21.62 9.62,22.38 9.62,23.88 R8.1
  Top 0.6: 29.88,16.73 U$52.GND1
  Bottom 0.2: 15.12,10.75 15.5,10.75
  other vias: 17.12,18.5 17.12,15.5 20.12,15.5 11.25,31.75 28.12,17 4.88,27.62 24.88,25.25 28.62,26 24.88,21.5 3.88,34.88
  pour Top (isolate 0.254): 1,41.25 1.25,41 13,41 13,29 31,29.25 31,9 1,9
  pour Bottom (isolate 0.254): 1,9 31,9 31,29.25 13,29.25 13,41 1.25,41 1,41.25
I2C_SCL
  Top 0.2: U$14.2 17.25,10 10K1.2 17,11.25 U1.P$10
I2C_SDA
  Top 0.2: U$14.32 18.62,8.75 18.62,11.06 10K2.2 17.65,12.04 U1.P$11
IRQ
  Top 0.2: U4.24 21.5,24 21.88,23.62 21.88,22.38 20.25,20.75 U1.P$26
LPC_XTAL1
  Top 0.2: Y3.3 11,18.45 11,17.88 11.5,17.38 15,17.38 U1.P$4
  Top 0.813: C19.2 10.6,20.6 Y3.3
LPC_XTAL2
  Top 0.2: Y3.1 13.25,15.5 13.25,16.25 13.75,16.75 15.1,16.75 U1.P$5
  Top 0.813: C20.2 12.9,14.03 Y3.1
MCLK
  Top 0.2: U1.P$3 15.9,17.98 16.12,17.75 16.12,14.5 15.75,14.12 15.5,14.12 13.38,12 13.38,11.5 13.38,11.25 | U$14.7 14.75,9.88 13.38,11.25 | 13.38,11.12 13.38,11.25
MISO  (via drill 0.3)
  Top 0.2: U$14.9 13.38,8.75 v13.38,9.5 | v21.88,13.88 21.95,13.92 U1.P$17 | v19.38,23.5 19.5,23.62 U4.20
  Top 0.4: U$26.2 v3.74,22.26 v3.75,22.25 | U$1.2 v3.74,12.26 v3.75,12.25 | U$22.2 v3.74,17.26 v3.75,17.25
  Bottom 0.2: v3.75,22.25 3.5,22.5 | v3.75,22.25 v3.74,22.24 | v3.75,22.25 3.5,22 3.5,17.5 v3.75,17.25 3.5,17 3.5,12.5 v3.75,12.25 3.5,12 3.5,9.5 4,9 4.5,9 5.25,9.75 12.75,9.75 13,9.5 v13.38,9.5 18.75,9.5 21.88,12.62 v21.88,13.88 21.75,14 21.75,21 19.5,23.25 v19.38,23.5
MOSI  (via drill 0.3)
  Top 0.2: v22.62,13.88 22.75,14 22.75,15.12 22.5,15.38 U1.P$18 | v20.62,23.5 20.5,23.62 U4.22
  Top 0.4: v4.28,19.72 U$26.5 | v4.25,9.75 4.28,9.72 U$1.5 8.4,9.72 v9,9.12 | U$22.5 4.28,14.72 v4.25,14.75
  Bottom 0.2: v4.25,9.75 4.5,10 4.5,14.5 v4.25,14.75 4.5,15 4.5,19.5 v4.28,19.72 4.5,19.94 | v20.62,23.5 20.62,22.62 22.12,21.12 22.12,14.5 22.62,14 v22.62,13.88 22.5,13.75 22.5,12.62 19,9.12 13.88,9.12 13.62,8.88 13.12,8.88 12.88,9.12 v9,9.12
N$1
  Top 0.2: U1.P$28 18.95,20.8 18.12,21.62 16.75,21.62 LED2.C
N$2
  Top 0.2: C8.2 15,1.75
  Top 0.25: U$14.20 15.75,2.5 15,1.75
N$3
  Top 0.25: X1.1 6.5,3.25 10,3.25 11.5,1.75 C8.1
  Top 0.8: X1.1 C3.1
N$4
  Top 0.25: X4.1 25.5,3.25 21.75,3.25 20.25,1.75 C7.1
  Top 0.8: X4.1 C4.1
N$5
  Top 0.2: U4.13 U4.14 15.88,26 C11.1
N$6
  Top 0.2: C7.2 17,1.75
  Top 0.25: U$14.21 16.25,2.5 17,1.75
N$7
  Top 0.2: C16.1 17.75,3.38
  Top 0.25: 17.75,3.38 U$14.24
N$8
  Top 0.2: C15.1 14.25,3.38
  Top 0.25: 14.25,3.38 U$14.17
N$9
  Top 0.25: U$14.25 18.5,4.12 C16.2
N$10
  Top 0.25: U$14.16 13.5,4.12 C15.2
N$11
  Top 0.4: R1.1 25.12,10.88 25.88,10.88 26.12,10.62 26.12,8.24 U5.4
  Top 0.8: R2.2 R1.1
RADIORST  (via drill 0.3)
  Top 0.2: U4.8 17.43,29.2 v17.38,29.12 | U1.P$24 24.1,19.27 v24.12,19.25
  Bottom 0.2: v24.12,19.25 23.62,19.25 23.25,19.62 23.25,21.5 22.25,22.5 22.25,23.5 17.38,28.38 v17.38,29.12
RESET  (via drill 0.3)
  Top 0.2: U1.P$2 15.88,18.62 16.12,18.88 16.12,19.25 16.38,19.5 21.12,19.5 21.5,19.88 25,19.88 v25.5,19.38 | v26.62,20 26.62,20.12 27.12,20.62 27.25,20.62 27.32,20.7 U$52.4 27.7,20.7 28,21 28,23.12 10K.2
  Bottom 0.2: v25.5,19.38 25.75,19.38 26.38,20 v26.62,20
RF_CS  (via drill 0.3)
  Top 0.2: v21.25,23 21.25,23.75 21,24 U4.23 | U1.P$22 23.02,17.98 v23.12,18
  Bottom 0.2: v21.25,23 21.25,22.5 22.5,21.25 22.5,18.38 22.88,18 v23.12,18
RF_XTAL1
  Top 0.2: U4.26 23.32,25.5 Y2.3 23.88,25.5 23.88,25.75 24.62,26.5 26.75,26.5 27.38,27.12 C17.2
RF_XTAL2
  Top 0.2: U4.25 22.62,25 22.88,24.75 22.88,24.12 23.12,23.88 26,23.88 | 26,23.88 26.62,23.88 27,24.25 27,25.88 27.62,26.5 28,26.5 28.38,26.88 28.38,27.12 C18.2 | Y2.1 26.02,23.77 26,23.88
RFN
  Top 0.2: C13.1 18.75,30.75 19.5,30 U4.5
RFP
  Top 0.2: C14.1 20.75,30.75 20,30 U4.4
SCLK  (via drill 0.3)
  Top 0.2: U$14.8 14.25,9.75 13.75,10.25 v13.38,10.25 | v21,12.69 20.81,12.69 20.25,13.25 U1.P$15 | v18.75,23 18.75,23.75 19,24 U4.19
  Top 0.4: v5.26,20.99 U$26.6 | v5.25,11 U$1.6 | U$22.6 v5.26,15.99 v5.25,16
  Bottom 0.2: v18.75,23 19.12,23 21.38,20.88 21.38,14.5 21,14.12 v21,12.69 21,12.38 18.5,9.88 13.88,9.88 13.5,10.25 v13.38,10.25 13.25,10.25 13.12,10.12 5.25,10.12 5,10.38 5,10.75 v5.25,11 5,11.25 5,15.75 v5.25,16 5,16.25 5,20.75 5.24,20.99 v5.26,20.99 5,21.25
SLP_TR  (via drill 0.3)
  Top 0.2: v16.5,27.5 U4.11 | U1.P$23 v23.62,18.62
  Bottom 0.2: v16.5,27.5 17.75,27.5 21.88,23.38 21.88,22.38 22.88,21.38 22.88,19 23.25,18.62 v23.62,18.62
SWCLK  (via drill 0.3)
  Top 0.2: U$52.1 27.57,18.38 v26.62,18.38 | U1.P$19 24.88,16.02 v24.88,16
  Bottom 0.2: v24.88,16 24.88,17.38 25.88,18.38 v26.62,18.38
SWDIO
  Top 0.2: U$52.2 27.5,19.25 26.5,19.25 25.5,20.25 20.9,20.25 U1.P$25
UNBAL
  Top 0.2: 19,36.75 18.95,36.75 B1.1
  Top 2: J$1.SIG 19,39.25 19,36.75
(copper drawn outside any net)
  shapes: Top circle x1

### Text on the board
Bottom: Richard Meadows 2012
bStop: Richard Meadows 2012